# Altium project 我的平衡车工程.PrjPcb
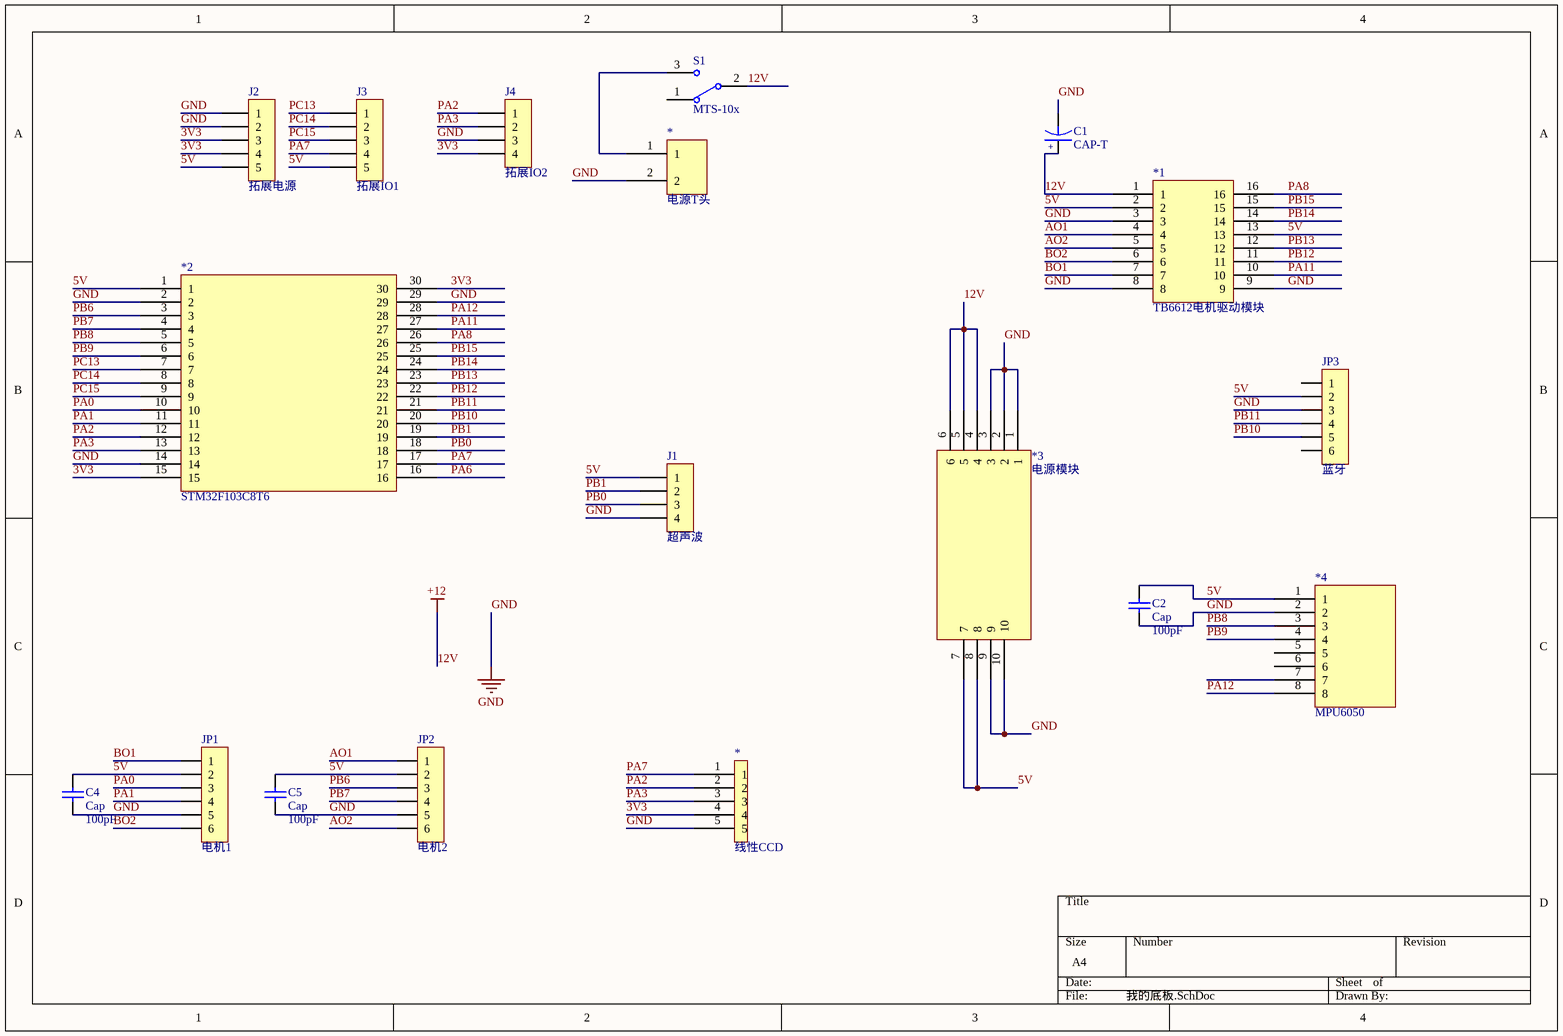
[diagram p0: 我的底板.SchDoc]
1 sheet, 18 parts. Net scope: global (net labels, ports and power ports of the same name join across sheets).
Board file: 我的底板.PcbDoc

## Sheet 我的底板.SchDoc
size A4

### Parts
(Parts that share a designator on the sheet are numbered #1, #2 ... from top to bottom, then left to right.)
*1  TB6612电机驱动模块  [电源模块]
*2  STM32F103C8T6  [STM32_DIP30]
*3  电源模块  [LM2596]
*4  MPU6050  [MPU6050]
*#1  电源T头  [T型接口封装]
*#2  线性CCD  [XH2.54-LI-5P]
C1  CAP-T  [CAP 2.0*5*11]
C2  Cap  value 100pF  [C-RAD]
C4  Cap  value 100pF  [C-RAD]
C5  Cap  value 100pF  [C-RAD]
J1  超声波  [HDR1X4]
J2  拓展电源  [HDR1X5]
J3  拓展IO1  [HDR1X5]
J4  拓展IO2  [HDR1X4]
JP1  电机1  [XH2.54-LI-6P]
JP2  电机2  [XH2.54-LI-6P]
JP3  蓝牙  [HDR1X6]
S1  MTS-10x  [MTS-10x]

### Nets
12V: *1.1 *3.4 *3.5 *3.6 C1.1 S1.2  [also labelled +12]
GND: *1.3 *1.8 *1.9 *2.2 *2.14 *2.29 *3.1 *3.2 *3.3 *3.9 *3.10 *4.2 *#1.2 *#2.5 C1.2 C2.1 C4.1 C5.1 J1.4 J2.1 J2.2 J4.3 JP1.5 JP2.5 JP3.3
3V3: *2.15 *2.30 *#2.4 J2.3 J2.4 J4.4
5V: *1.2 *1.13 *2.1 *3.7 *3.8 *4.1 C2.2 C4.2 C5.2 J1.1 J2.5 J3.5 JP1.2 JP2.2 JP3.2
AO1: *1.4 JP2.1
AO2: *1.5 JP2.6
BO1: *1.7 JP1.1
BO2: *1.6 JP1.6
PA0: *2.10 JP1.3
PA1: *2.11 JP1.4
PA2: *2.12 *#2.2 J4.1
PA3: *2.13 *#2.3 J4.2
PA6: *2.16
PA7: *2.17 *#2.1 J3.4
PA8: *1.16 *2.26
PA11: *1.10 *2.27
PA12: *2.28 *4.8
PB0: *2.18 J1.3
PB1: *2.19 J1.2
PB6: *2.3 JP2.3
PB7: *2.4 JP2.4
PB8: *2.5 *4.3
PB9: *2.6 *4.4
PB10: *2.20 JP3.5
PB11: *2.21 JP3.4
PB12: *1.11 *2.22
PB13: *1.12 *2.23
PB14: *1.14 *2.24
PB15: *1.15 *2.25
PC13: *2.7 J3.1
PC14: *2.8 J3.2
PC15: *2.9 J3.3
Net*#1_1: *#1.1 S1.3

Not connected (* = marked no-connect by the designer): *4 5 6 7; JP3 1 6; S1 1

### Notes on the sheet
- (in symbol CAP-T) +

### Library data of the parts
*#2 = Header 5: 5P接插件
C1 = CAP-T: 钽电容
C2 C4 C5 = Cap: Capacitor; Published: 8-Jun-2000; LatestRevisionDate: 17-Jul-2002; LatestRevisionNote: Re-released for DXP Platform.; PackageReference: RAD-0.3; Publisher: Altium Limited; PackageDescription: Radial Cap, Thru-Hole; 2 Leads; 0.3 in Pin Spacing
J1 J4 = CON4: Connector
J2 J3 = CON5: Connector
JP1-JP3 = Header 6: 6P接插件; 版权归属: 源创客; BOM名称: 6P接插件; 学习资源: www.ooocke.com
S1 = MTS-10x: MTS10x系列3脚扭子开关; 版权归属: 源创客; BOM名称: MTS10x系列3脚扭子开关; 学习资源: www.ooocke.com